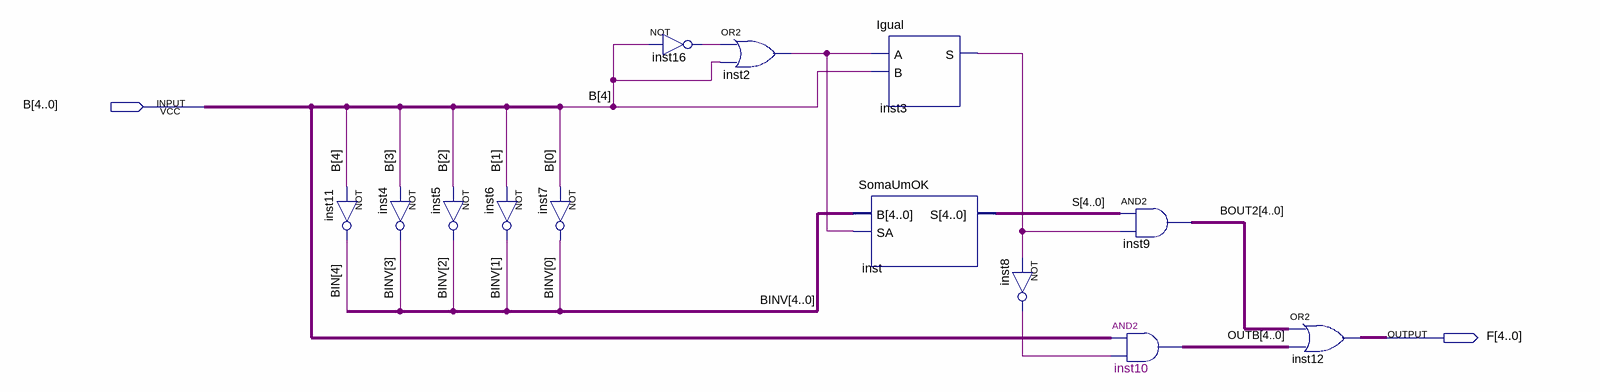
[diagram p0: schematic sheet]
// Quartus schematic ComplementoDe2.bdf as structural Verilog: 13 symbols, 2 pins
module ComplementoDe2 (
  input  [4:0] B,
  output [4:0] F
);

  wire inst2_out, inst3_s, inst8_out, inst16_out;
  wire [4:0] BINV, BOUT2, OUTB, S;
  wire [4:4] BIN;

  not inst11 (BIN[4], B[4]);
  not inst4 (BINV[3], B[3]);
  not inst5 (BINV[2], B[2]);
  not inst6 (BINV[1], B[1]);
  not inst7 (BINV[0], B[0]);
  not inst16 (inst16_out, B[4]);
  or inst2 (inst2_out, inst16_out, B[4]);
  Igual inst3 (.A(inst2_out), .B(B[4]), .S(inst3_s));
  SomaUmOK inst (.B(BINV), .SA(inst2_out), .S(S));
  not inst8 (inst8_out, inst3_s);
  assign BOUT2 = S & {5{inst3_s}};  // AND2 inst9, 5 bits wide
  assign OUTB = B & {5{inst8_out}};  // AND2 inst10, 5 bits wide
  assign F = BOUT2 | OUTB;  // OR2 inst12, 5 bits wide
endmodule
